# EAGLE design board1.7 (EAGLE 6.2)
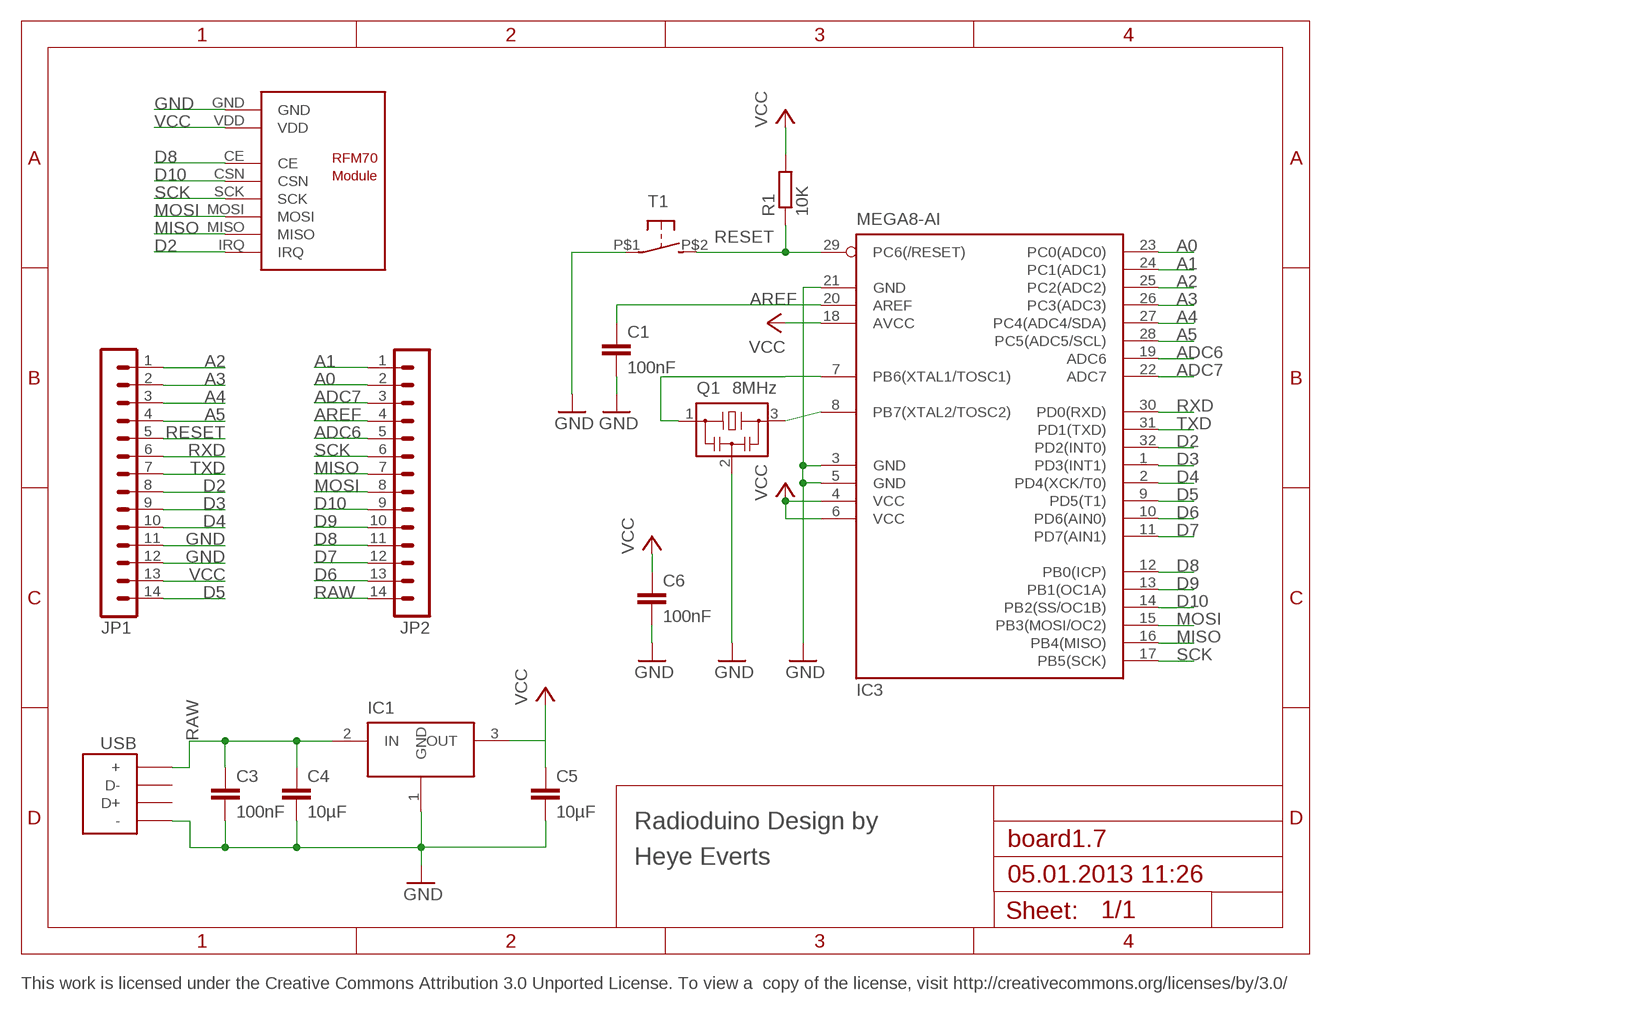
[diagram p0: schematic, sheet 1]

## Parts
C1  100nF  C-EUC0603K  [C0603K]
C3  100nF  C-EUC0603K  [C0603K]
C4  10µF  C-EUC0805K  [C0805K]
C5  10µF  C-EUC0805K  [C0805K]
C6  100nF  C-EUC0603K  [C0603K]
IC1  TS1117CP33  [TO252]
IC3  MEGA8-AI  [TQFP32-08]
JP1  MA14-1  [MA14-1]
JP2  MA14-1  [MA14-1]
Q1  8MHz  CSTCE8M00G52  [CSTCE8M00G52]
R1  10K  R-EU_R0603  [R0603]
RFM70  RFM70  [RFM70]
T1  DTSM-3  [DTSM31N]
USB  USB-MICRO-B-RS  [USB-MICRO-B-RS]

## Nets
A0: IC3.23(PC0(ADC0)) JP2.2
A1: IC3.24(PC1(ADC1)) JP2.1
A2: IC3.25(PC2(ADC2)) JP1.1
A3: IC3.26(PC3(ADC3)) JP1.2
A4: IC3.27(PC4(ADC4/SDA)) JP1.3
A5: IC3.28(PC5(ADC5/SCL)) JP1.4
ADC6: IC3.19(ADC6) JP2.5
ADC7: IC3.22(ADC7) JP2.3
AREF: C1.1 IC3.20(AREF) JP2.4
D2: IC3.32(PD2(INT0)) JP1.8 RFM70.IRQ
D3: IC3.1(PD3(INT1)) JP1.9
D4: IC3.2(PD4(XCK/T0)) JP1.10
D5: IC3.9(PD5(T1)) JP1.14
D6: IC3.10(PD6(AIN0)) JP2.13
D7: IC3.11(PD7(AIN1)) JP2.12
D8: IC3.12(PB0(ICP)) JP2.11 RFM70.CE
D9: IC3.13(PB1(OC1A)) JP2.10
D10: IC3.14(PB2(SS/OC1B)) JP2.9 RFM70.CSN
GND: C1.2 C3.2 C4.2 C5.2 C6.2 IC1.1(GND) IC3.3(GND) IC3.5(GND) IC3.21(GND) JP1.11 JP1.12 Q1.2 RFM70.GND T1.P$1(P) USB.P$5(-)
MISO: IC3.16(PB4(MISO)) JP2.7 RFM70.MISO
MOSI: IC3.15(PB3(MOSI/OC2)) JP2.8 RFM70.MOSI
RAW: C3.1 C4.1 IC1.2(IN) JP2.14 USB.P$1(+)
RESET: IC3.29(PC6(/RESET)) JP1.5 R1.1 T1.P$2(S)
RXD: IC3.30(PD0(RXD)) JP1.6
SCK: IC3.17(PB5(SCK)) JP2.6 RFM70.SCK
TXD: IC3.31(PD1(TXD)) JP1.7
VCC: C5.1 C6.1 IC1.3(OUT) IC3.4(VCC) IC3.6(VCC) IC3.18(AVCC) JP1.13 R1.2 RFM70.VDD
XTAL1: IC3.7(PB6(XTAL1/TOSC1)) Q1.1
XTAL2: IC3.8(PB7(XTAL2/TOSC2)) Q1.3
Unconnected: USB.P$2(D-) USB.P$3(D+)

## Notes on the sheet
- Radioduino Design by
- Heye Everts
- 05.01.2013 11:26
- This work is licensed under the Creative Commons Attribution 3.0 Unported License. To view a  copy of the license, visit http://creativecommons.org/licenses/by/3.0/

## Library data of the parts
C1 C3-C6 = resistor:C-EU: CAPACITOR, European symbol
IC1 = diverses:TS1117CP33
IC3 = diverses:MEGA8: MICROCONTROLLER 8 Kbytes FLASH, 1 kbytes SRAM, 512 bytes EEPROM, USART, 6-channel 10 bit ADC, 2-channel 8 bit ADC Pin compatible with Atmega48, ATMega88, ATMega168 Source: avr.lbr; MPN: ATMEGA8-16AU; OC_FARNELL: 9171371; OC_NEWARK: 73M8863
JP1 JP2 = diverses:MA14-1: PIN HEADER; OC_FARNELL: unknown; OC_NEWARK: unknown
Q1 = diverses:CSTCE8M00G52
R1 = resistor:R-EU_: RESISTOR, European symbol
RFM70 = rfm70:RFM70: RFM70 2.4 Ghz Funkmodul Autor: Daniel Weber Website: http://projects.web4clans.com Email: daniel.weber@web4clans.com
T1 = newlib:DTSM-3
USB = diverses:USB-MICRO-B-RS

## Board
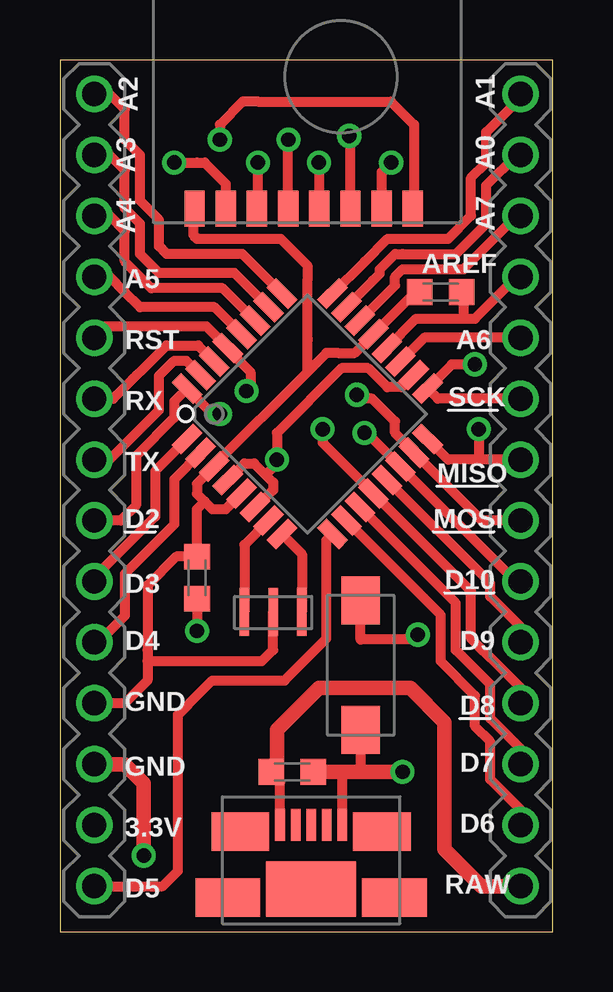
[diagram p1: board, top side]
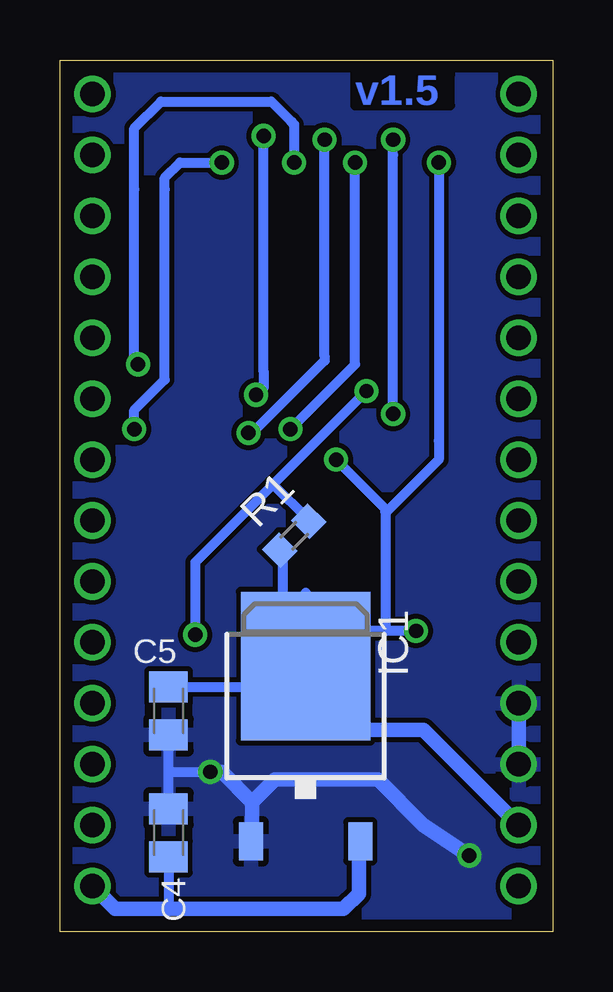
[diagram p2: board, bottom side, seen from below]

Size 20.56 x 36.34 mm. Coordinates in mm from the lower left corner, seen from the top.
Outline: 0,0 20.56,0 20.56,36.34 0,36.34 0,0
Copper layers (1*16): Top 0.035mm / dielectric 1.5mm / Bottom 0.035mm
Design rules: minimum track width 10mil, minimum drill 0.3mm, track to track 8mil, track to pad 8mil, pad to pad 8mil, via to via 8mil, smd to smd 8mil, copper to edge 20mil, drill to drill 8mil, minimum pad ring 10mil, minimum via ring 8mil, stop-mask expansion 4mil, vias tented up to drill 0mil, thermal gap 10mil

### Footprints (pad centres in the part's own frame; a part is rotated, then mirrored left to right if it is on the bottom)
C0603K = smd 1.05 x 1.08: 1 -0.875,0; 2 0.875,0
C0805K = smd 1.3 x 1.6: 1 -1,0; 2 1,0
TO252 = smd 1 x 1.6: 1 -2.28,-4.8; 2 2.28,-4.8 | smd 5.4 x 6.2: 3 0,2.5
TQFP32-08 = smd 1.27 x 0.559: 1 -4.293,2.8; 2 -4.293,2; 3 -4.293,1.2; 4 -4.293,0.4; 5 -4.293,-0.4; 6 -4.293,-1.2; 7 -4.293,-2; 8 -4.293,-2.8; 17 4.293,-2.8; 18 4.293,-2; 19 4.293,-1.2; 20 4.293,-0.4; 21 4.293,0.4; 22 4.293,1.2; 23 4.293,2; 24 4.293,2.8 | smd 0.559 x 1.27: 9 -2.8,-4.293; 10 -2,-4.293; 11 -1.2,-4.293; 12 -0.4,-4.293; 13 0.4,-4.293; 14 1.2,-4.293; 15 2,-4.293; 16 2.8,-4.293; 25 2.8,4.293; 26 2,4.293; 27 1.2,4.293; 28 0.4,4.293; 29 -0.4,4.293; 30 -1.2,4.293; 31 -2,4.293; 32 -2.8,4.293
MA14-1 = drill 1.016: 1 -24.13,0; 2 -21.59,0; 3 -19.05,0; 4 -16.51,0; 5 -13.97,0; 6 -11.43,0; 7 -8.89,0; 8 -6.35,0; 9 -3.81,0; 10 -1.27,0; 11 1.27,0; 12 3.81,0; 13 6.35,0; 14 8.89,0
CSTCE8M00G52 = smd 0.4 x 2: 1 -1.2,0; 2 0,0; 3 1.2,0
R0603 = smd 1 x 1.1: 1 -0.85,0; 2 0.85,0
RFM70 = smd 0.85 x 1.5: CE 2.5,-14.3; CSN 3.8,-14.3; GND -0.1,-14.3; IRQ 9,-14.3; MISO 7.7,-14.3; MOSI 6.4,-14.3; SCK 5.1,-14.3; VDD 1.2,-14.3
DTSM31N = smd 2 x 1.6: P$1 0,0; P$2 5.4,0
USB-MICRO-B-RS = smd 0.4 x 1.35: P$1 -1.3,3.825; P$2 -0.65,3.825; P$3 0,3.825; P$4 0.65,3.825; P$5 1.3,3.825 | smd 2.4 x 1.6: P$6 -2.95,3.55; P$10 2.95,3.55 | smd 2.7 x 1.6: P$7 -3.475,0.8; P$9 3.475,0.8 | smd 3.75 x 2.3: P$8 0,1.15

### Placement (x,y rotation side)
C1  15.88,26.67 180 top
C3  9.68,6.67 0 top
C4  16.03,4.13 90 bottom
C5  16.03,9.21 270 bottom
C6  5.71,14.76 90 top
IC1  10.32,8.57 0 bottom
IC3  10.32,21.59 45 top
JP1  1.43,10.79 270 top
JP2  19.21,10.79 270 top
Q1  8.89,13.34 0 top
R1  10.79,16.51 225 bottom
RFM70  5.71,44.45 0 top
T1  12.54,8.41 90 top
USB  10.48,0.64 0 top

### Tracks (layer width: path | path; a pad name or v marks a point on that pad's centre or on a via)
A0
  Top 0.406: IC3.23 13.05,27.15 13.34,27.43 13.34,27.62 13.97,28.26 14.29,28.26 16.51,28.26 17.78,29.53 17.78,31.11 19.05,32.38 JP2.2
A1
  Top 0.406: IC3.24 12.71,27.94 13.66,28.89 15.88,28.89 16.19,28.89 17.14,29.84 17.14,31.43 17.78,32.07 17.78,33.34 19.21,34.77 JP2.1
A2
  Top 0.406: IC3.25 7.61,28.26 4.45,28.26 4.13,28.57 4.13,29.69 3.33,30.48 3.33,31.75 3.33,32.38 2.7,33.02 2.7,34.29 2.06,34.92 JP1.1
A3
  Top 0.406: IC3.26 7.27,27.46 4.13,27.46 3.33,28.26 3.33,29.53 2.7,30.16 2.7,31.75 2.06,32.38 JP1.2
A4
  Top 0.406: IC3.27 6.78,26.83 3.81,26.83 2.7,27.94 2.7,29.21 2.06,29.84 JP1.3
A5
  Top 0.406: IC3.28 6.44,26.04 3.33,26.04 2.7,26.67 2.06,27.3 JP1.4
ADC6
  Top 0.406: JP2.5 15.19,24.77 IC3.19
ADC7
  Top 0.406: IC3.22 13.38,26.35 13.97,26.94 13.97,27.3 14.29,27.62 14.61,27.62 16.83,27.62 19.05,29.84 JP2.3
AREF
  Top 0.406: IC3.20 14.85,25.56 16.83,25.56 | 16.83,25.56 17.3,25.56 19.05,27.3 JP2.4 | C1.1 16.83,26.59 16.83,25.56
D2  (via drill 0.6)
  Top 0.406: JP1.8 2.54,17.14 3.17,17.78 3.17,19.84 4.76,21.43 4.76,22.1 IC3.32 6.2,21.75 v6.67,21.59 | RFM70.IRQ 14.76,30.2 14.76,33.66 13.81,34.61 8.26,34.61 7.62,34.61 6.67,33.66 v6.67,33.02
  Bottom 0.406: v6.67,21.59 6.67,32.38 v6.67,33.02
D3
  Top 0.406: IC3.1 3.97,19.2 3.97,17.3 1.43,14.76 JP1.9
D4
  Top 0.406: IC3.2 4.76,18.86 4.76,16.99 2.7,14.92 2.7,13.81 2.7,13.49 2.7,13.18 1.59,12.06 JP1.10
D5
  Top 0.406: JP1.14 4.29,1.91 4.92,2.54 4.92,9.05 5.87,10 6.35,10.48 9.37,10.48 11.11,12.22 11.11,16.31 IC3.9
D6
  Top 0.406: JP2.13 19.21,5.08 17.94,6.35 17.94,7.94 17.3,8.57 17.3,9.84 15.88,11.27 15.88,13.21 IC3.10
D7
  Top 0.406: JP2.12 19.21,7.62 17.94,8.89 17.94,10.16 17.94,10.32 16.51,11.75 16.51,13.7 IC3.11
D8  (via drill 0.6)
  Top 0.406: JP2.11 19.21,10.16 17.94,11.43 17.46,11.91 17.14,12.22 17.14,14.2 IC3.12 10.95,20.39 v10.95,20.95 | RFM70.CE 8.26,30.19 v8.26,32.07
  Bottom 0.406: v8.26,32.07 8.26,23.65 v10.95,20.95
D9
  Top 0.406: JP2.10 19.21,12.7 17.94,13.97 17.94,14.54 IC3.13
D10  (via drill 0.6)
  Top 0.406: JP2.9 19,14.61 IC3.14 12.81,20.8 v12.7,20.8 | RFM70.CSN 9.52,33.01 v9.53,33.02
  Bottom 0.406: v9.53,33.02 9.53,23.97 9.53,23.81 12.54,20.8 v12.7,20.8
GND  (via drill 0.6)
  Top 0.406: 6.03,17.94 5.71,18.26 5.71,18.68 IC3.3 6.43,19.45 10.32,23.34 | 6.03,17.94 6.19,17.78 6.35,17.62 6.92,17.62 IC3.5 6.99,17.69 | 10.32,23.34 10.32,24.13 10.32,24.92 | 10.32,24.61 10.32,24.77 10.32,24.92 | 10.32,24.92 10.32,27.15 10.32,27.78 9.21,28.89 5.71,28.89 5.56,29.05 5.56,30.09 RFM70.GND | 6.03,17.94 5.71,17.62 C6.2 4.84,15.64 3.65,14.45 3.65,11.75 3.65,11.27 | 3.65,11.27 3.65,10.48 2.7,9.53 JP1.11 | 3.65,11.27 8.41,11.27 8.89,11.75 Q1.2 | USB.P$5 11.78,6.72 C3.2 | C1.2 14.83,26.67 IC3.21 12.29,24.13 11.59,24.13 11.11,24.13 10.32,23.34 | T1.P$1 12.54,6.67
  Top 0.61: JP1.12 2.7,6.99 3.49,6.19 v3.49,3.17 | C3.2 12.54,6.67 12.86,6.67 v14.29,6.67
  Bottom 0.406: 16.08,7.78 C5.2 C4.2 16.03,6.67 v14.29,6.67 | 12.54,3.83 IC1.1
  Bottom 0.61: JP1.11 JP1.12 | v3.49,3.17 5.4,4.45 7.3,6.35 11.59,6.35 12.54,5.4 | 12.54,5.4 12.54,3.83 | 12.54,5.4 13.81,6.67 v14.29,6.67
  pour Bottom: 0,0 19.84,0 19.84,36.35 0,36.35
MISO  (via drill 0.6)
  Top 0.406: JP2.7 17.46,19.68 | 17.46,19.68 16.18,19.68 IC3.16 | v17.46,20.95 17.46,19.68 | v13.81,32.07 13.41,31.67 RFM70.MISO
  Bottom 0.406: v17.46,20.95 17.46,21.75 16.19,23.02 16.19,30.96 16.19,31.43 15.56,32.07 v13.81,32.07
MOSI  (via drill 0.6)
  Top 0.406: JP2.8 17.59,17.14 IC3.15 | IC3.15 14.77,20 | IC3.15 14.45,20.29 14.45,20.32 13.97,20.8 13.97,21.27 13.02,22.23 12.54,22.23 v12.38,22.38 | 12.06,30.2 RFM70.MOSI 12.12,33.13 v12.06,33.18
  Bottom 0.406: v12.06,33.18 12.06,23.34 12.06,22.7 v12.38,22.38
RAW
  Top 0.406: USB.P$1 9.18,6.24 C3.1 9.05,6.75
  Top 0.61: JP2.14 17.57,1.91 16.03,3.44 16.03,8.73 14.61,10.16 10.79,10.16 9.05,8.41 9.05,6.75
  Bottom 0.406: 8.1,3.71 IC1.2 | C4.1 16.03,0.95
  Bottom 0.61: 8.1,3.71 8.1,1.59 8.73,0.95 9.43,0.95 16.03,0.95 18.26,0.95 JP2.14
RESET  (via drill 0.6)
  Top 0.406: JP1.5 1.75,25.08 1.91,25.24 3.49,25.24 6.1,25.24 IC3.29 7,24.27 7.94,23.34 7.94,22.7 v7.78,22.54 | v14.92,12.38 14.72,12.18 12.54,12.18 T1.P$2
  Bottom 0.406: 14.92,14.92 14.92,14.76 | 14.92,14.76 v14.92,12.38 | v7.78,22.54 11.67,18.65 | 11.67,18.65 12.78,17.54 14.92,15.4 14.92,14.76 | R1.1 10.19,17.18 11.67,18.65
RXD
  Top 0.406: JP1.6 2.22,22.23 4.45,24.45 5.76,24.45 IC3.30
SCK  (via drill 0.6)
  Top 0.406: JP2.6 15.75,22.23 IC3.17 16.34,23.65 v17.3,23.65 | RFM70.SCK 10.81,31.93 v10.79,32.07
  Bottom 0.406: v17.3,23.65 17.46,23.81 17.46,30.96 17.46,33.5 16.35,34.61 11.75,34.61 10.95,33.81 10.79,33.66 10.79,32.23 v10.79,32.07
TXD
  Top 0.406: JP1.7 2.06,19.68 4.13,21.75 4.13,23.18 4.76,23.81 5.08,23.81 5.27,23.81 IC3.31
VCC  (via drill 0.6)
  Top 0.406: IC3.4 7.69,19.53 8.1,19.53 8.57,19.05 | 8.57,19.05 8.89,18.73 8.89,18.41 8.18,17.71 IC3.6 | 8.57,19.05 9.05,19.53 v9.05,19.68 9.05,20.8 11.75,23.5 12.86,23.5 13.65,22.7 14.26,22.7 IC3.18 | C6.1 v5.71,12.54 | 6.83,30.24 RFM70.VDD 6.92,31.18 6.03,32.07 5.71,32.07 v4.76,32.07
  Bottom 0.406: v4.76,32.07 4.76,20.48 4.76,19.68 | 10.75,9.73 10.32,10.16 10.32,10.48 | 10.32,10.48 IC1.3 | IC1.3 8.06,11.07 | 4.76,19.68 6.99,17.46 | 10.32,14.13 10.32,11.75 IC1.3 | v5.71,12.54 6.99,12.54 | 6.99,12.54 8.26,12.54 10.32,10.48 | 4.76,19.68 6.99,17.46 | 6.99,17.46 6.99,17.62 v9.05,19.68 | IC1.3 11.27,12.03 11.27,12.38 11.27,15.91 R1.2 | C5.1 11.18,10.21 IC1.3 | 6.99,17.46 6.99,12.54
  Bottom 0.61: JP1.13 3.97,6.99 5.4,8.41 10.64,8.41 10.32,8.73 10.32,11.75
XTAL1
  Top 0.406: 8.7,17.11 IC3.7 7.69,16.13 Q1.1
XTAL2
  Top 0.406: IC3.8 10.09,15.75 Q1.3

### Text on the board
Bottom: v1.5
tNames: A2 | A1 | A3 | A0 | A4 | A7 | A5 | AREF | RST | A6 | RX | SCK | TX | MISO | D2 | MOSI | D3 | D10 | D4 | D9 | GND | D8 | GND | D7 | 3.3V | D6 | RAW | D5
tDocu: This work is licensed under the Creative Commons Attribution 3.0 Unported License. | To view a copy of the license, visit http://creativecommons.org/licenses/by/3.0/